# EAGLE design eCog104_PS2_Module (EAGLE 6.6.0)
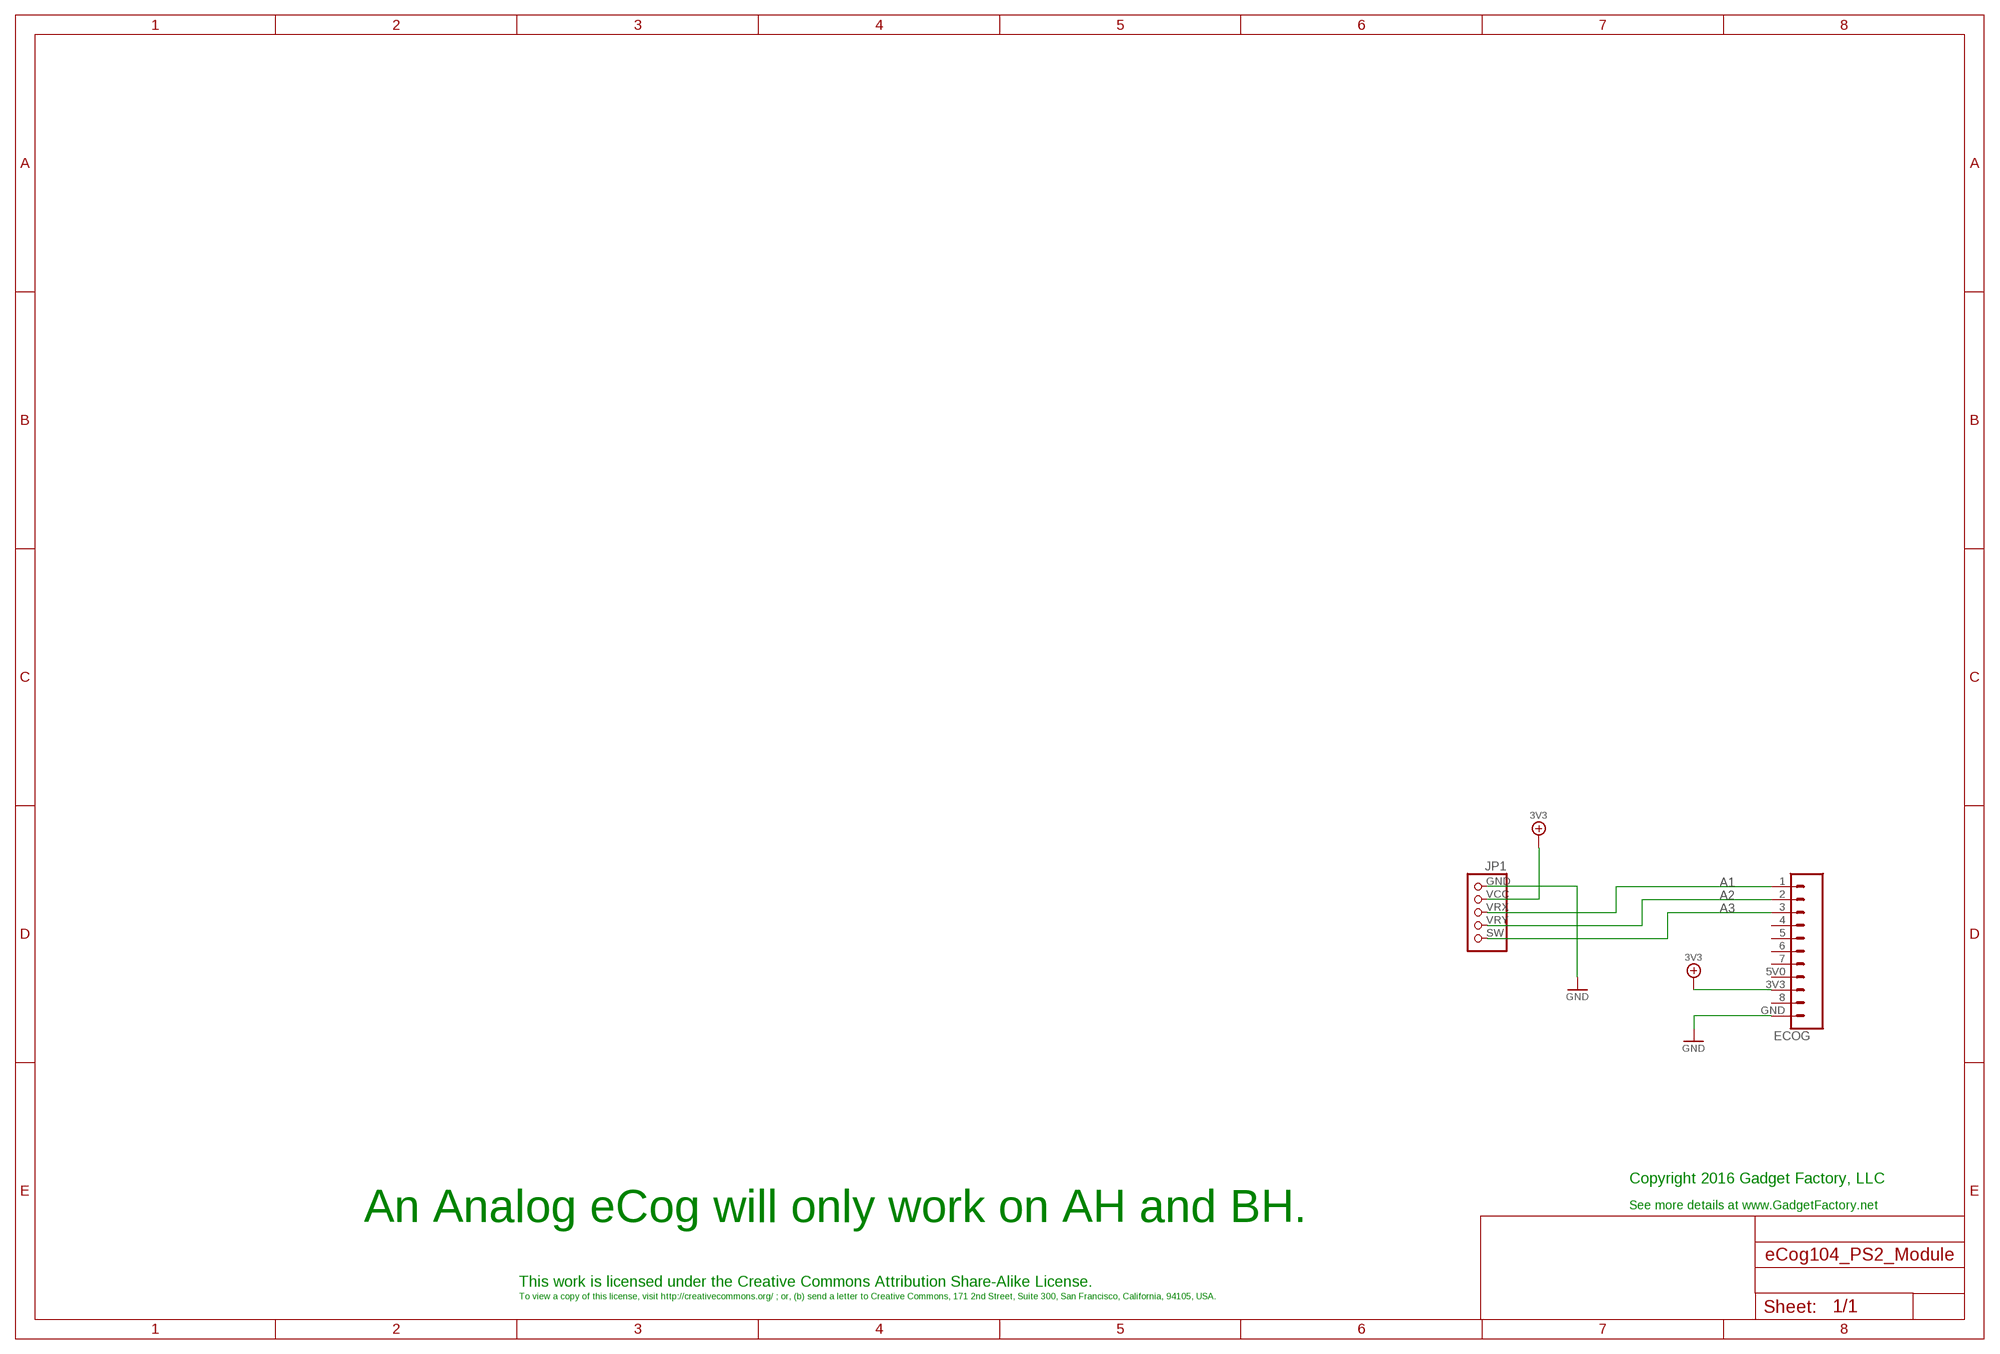
[diagram p0: schematic, sheet 1]

## Parts
ECOG  ECOG_GENERAL_ROWECOG_GENERAL_SMD  [ECOG_GENERAL_SMD]
JP1  PS2-MODULE  [PS2-MODULE]

## Nets
3V3: ECOG.3V3 JP1.VCC
A1: ECOG.1(G0) JP1.VRX
A2: ECOG.2(G1) JP1.VRY
A3: ECOG.3(G2) JP1.SW
GND: ECOG.GND JP1.GND
Unconnected: ECOG.4(G3) ECOG.5(G4) ECOG.5V0(5V) ECOG.6(G5) ECOG.7(G6) ECOG.8(G7)

## Notes on the sheet
- Copyright 2016 Gadget Factory, LLC
- See more details at www.GadgetFactory.net
- An Analog eCog will only work on AH and BH.
- This work is licensed under the Creative Commons Attribution Share-Alike License.
- To view a copy of this license, visit http://creativecommons.org/ ; or, (b) send a letter to Creative Commons, 171 2nd Street, Suite 300, San Francisco, California, 94105, USA.

## Library data of the parts
ECOG = eCogs:ECOG_GENERAL_ROW
JP1 = eCogs:PS2-MODULE: PIN HEADER

## Board
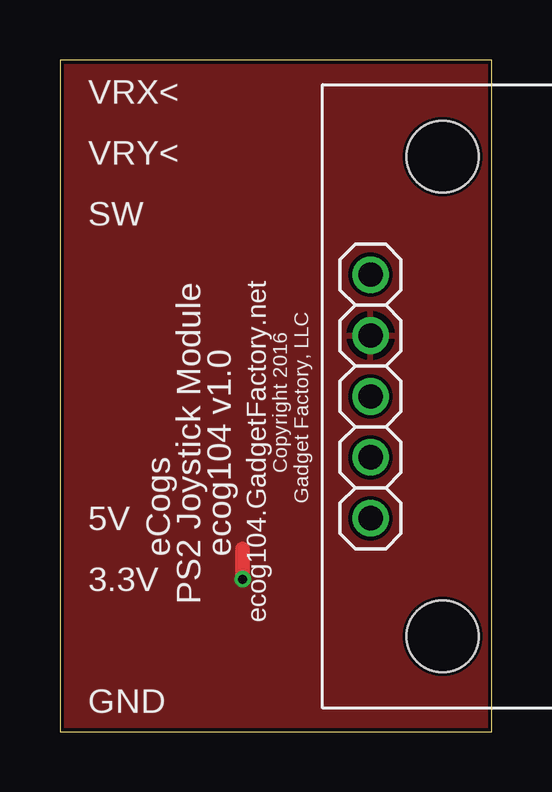
[diagram p1: board, top side]
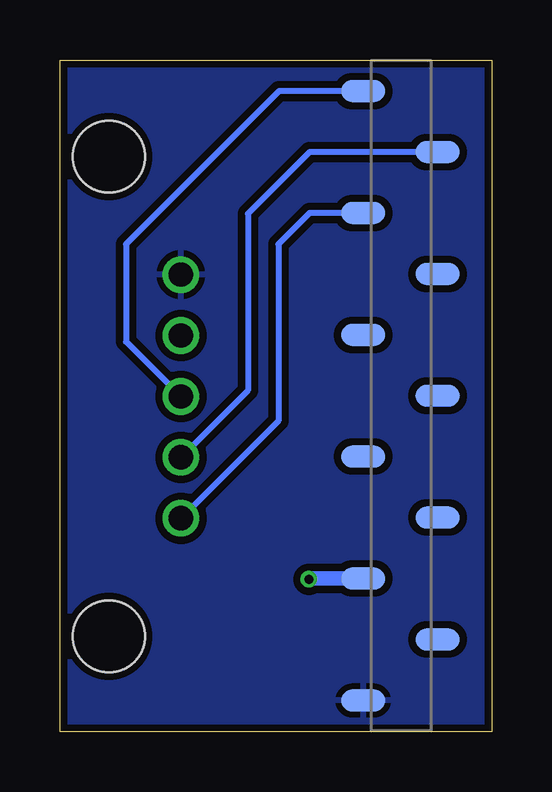
[diagram p2: board, bottom side, seen from below]

Size 18 x 28 mm. Coordinates in mm from the lower left corner, seen from the top.
Outline: 0,0 18,0 18,28 0,28 0,0
Copper layers (1*16): Top 0.035mm / dielectric 1.5mm / Bottom 0.035mm
Design rules "hackvana *": minimum track width 6mil, minimum drill 0.3mm, track to track 6mil, track to pad 6mil, pad to pad 6mil, via to via 6mil, smd to smd 0mil, copper to edge 6mil, drill to drill 6mil, minimum pad ring 10mil, minimum via ring 6mil, stop-mask expansion 2mil, vias tented up to drill 100mil, thermal gap 10mil

### Footprints (pad centres in the part's own frame; a part is rotated, then mirrored left to right if it is on the bottom)
ECOG_GENERAL_SMD = smd 1.841 x 0.914 bottom: 1 5.349,26.7; 2 2.251,24.16; 3 5.349,21.62; 3V3 5.349,6.38; 4 2.251,19.08; 5 5.349,16.54; 5V0 2.251,8.92; 6 2.251,14; 7 5.349,11.46; 8 2.251,3.84; GND 5.349,1.3
PS2-MODULE = drill 1.016: GND 5.08,0; SW -5.08,0; VCC 2.54,0; VRX 0,0; VRY -2.54,0 | hole 3: 10,-3; -10,-3

### Placement (x,y rotation side)
ECOG  0,0 0 top
JP1  12.95,13.97 90 top

### Tracks (layer width: path | path; a pad name or v marks a point on that pad's centre or on a via)
3V3  (via drill 0.38)
  Top 0.61: v7.62,6.35 7.62,7.62
  Bottom 0.61: ECOG.3V3 7.59,6.38 v7.62,6.35
  pour Top: 0,28 18,28 18,0 0,0
A1
  Bottom 0.254: ECOG.1 8.86,26.7 15.24,20.32 15.24,16.26 JP1.VRX
A2
  Bottom 0.254: ECOG.2 7.59,24.16 10.16,21.59 10.16,14.22 JP1.VRY
A3
  Bottom 0.254: ECOG.3 7.59,21.62 8.89,20.32 8.89,12.95 JP1.SW
GND
  pour Bottom (isolate 0.305): 0,28 18,28 18,0 0,0

### Text on the board
tPlace: VRX< | VRY< | SW | Copyright 2016 | Gadget Factory, LLC | 5V | eCogs | ecog104 v1.0 | 3.3V | PS2 Joystick Module | ecog104.GadgetFactory.net | GND